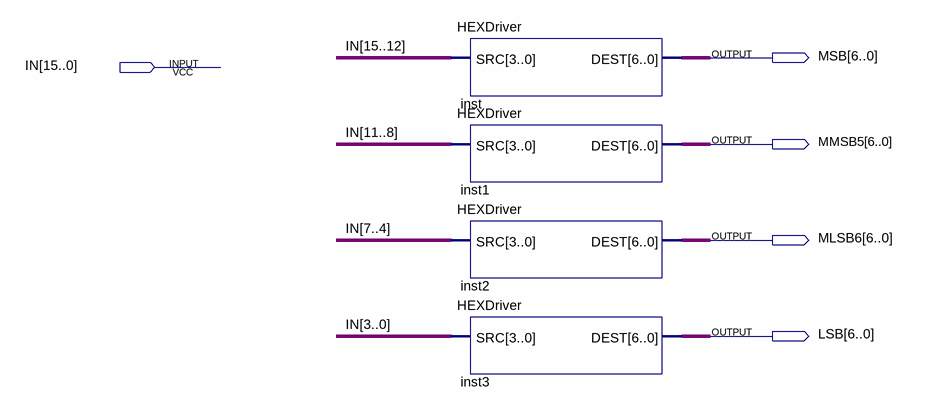
[diagram p0: schematic sheet]
// Quartus schematic Hex16Disp.bdf as structural Verilog: 4 symbols, 5 pins
module Hex16Disp (
  input  [15:0] IN,
  output [6:0] MSB,
  output [6:0] MMSB5,
  output [6:0] MLSB6,
  output [6:0] LSB
);

  HEXDriver inst (.SRC(IN[15:12]), .DEST(MSB));
  HEXDriver inst1 (.SRC(IN[11:8]), .DEST(MMSB5));
  HEXDriver inst2 (.SRC(IN[7:4]), .DEST(MLSB6));
  HEXDriver inst3 (.SRC(IN[3:0]), .DEST(LSB));
endmodule
